# Altium schematic sheet 12V_5V_switches.SchDoc: Data Logger - 12V,5V Switches
size A4; DocumentNumber: DL-MB-4; SheetNumber: 4; SheetTotal: 11
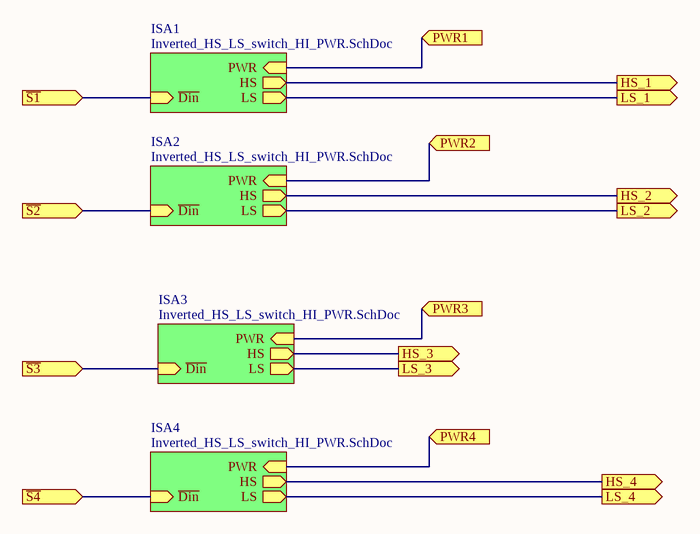
[diagram p0: 12V_5V_switches.SchDoc]

## Sub-sheets
ISA1 = Inverted_HS_LS_switch_HI_PWR.SchDoc: ~{Din} (in), HS (out), LS (out), PWR (in)
ISA2 = Inverted_HS_LS_switch_HI_PWR.SchDoc: ~{Din} (in), HS (out), LS (out), PWR (in)
ISA3 = Inverted_HS_LS_switch_HI_PWR.SchDoc: ~{Din} (in), HS (out), LS (out), PWR (in)
ISA4 = Inverted_HS_LS_switch_HI_PWR.SchDoc: ~{Din} (in), HS (out), LS (out), PWR (in)

## Ports
HS_1 (out), HS_2 (out), HS_3 (out), HS_4 (out), LS_1 (out), LS_2 (out), LS_3 (out), LS_4 (out), PWR1 (in), PWR2 (in), PWR3 (in), PWR4 (in), ~{S1} (in), ~{S2} (in), ~{S3} (in), ~{S4} (in)

## Nets
HS_1: port HS_1, sheet ISA1/HS
HS_2: port HS_2, sheet ISA2/HS
HS_3: port HS_3, sheet ISA3/HS
HS_4: port HS_4, sheet ISA4/HS
LS_1: port LS_1, sheet ISA1/LS
LS_2: port LS_2, sheet ISA2/LS
LS_3: port LS_3, sheet ISA3/LS
LS_4: port LS_4, sheet ISA4/LS
PWR1: port PWR1, sheet ISA1/PWR
PWR2: port PWR2, sheet ISA2/PWR
PWR3: port PWR3, sheet ISA3/PWR
PWR4: port PWR4, sheet ISA4/PWR
~{S1}: port ~{S1}, sheet ISA1/~{Din}
~{S2}: port ~{S2}, sheet ISA2/~{Din}
~{S3}: port ~{S3}, sheet ISA3/~{Din}
~{S4}: port ~{S4}, sheet ISA4/~{Din}

## Notes on the sheet
- Title
- Size
- Date:
- A4
- Number
- Time:
- Sheet
- of
- Revision
- File:
- Drawn By: